# EAGLE design common (EAGLE 9.6.1)
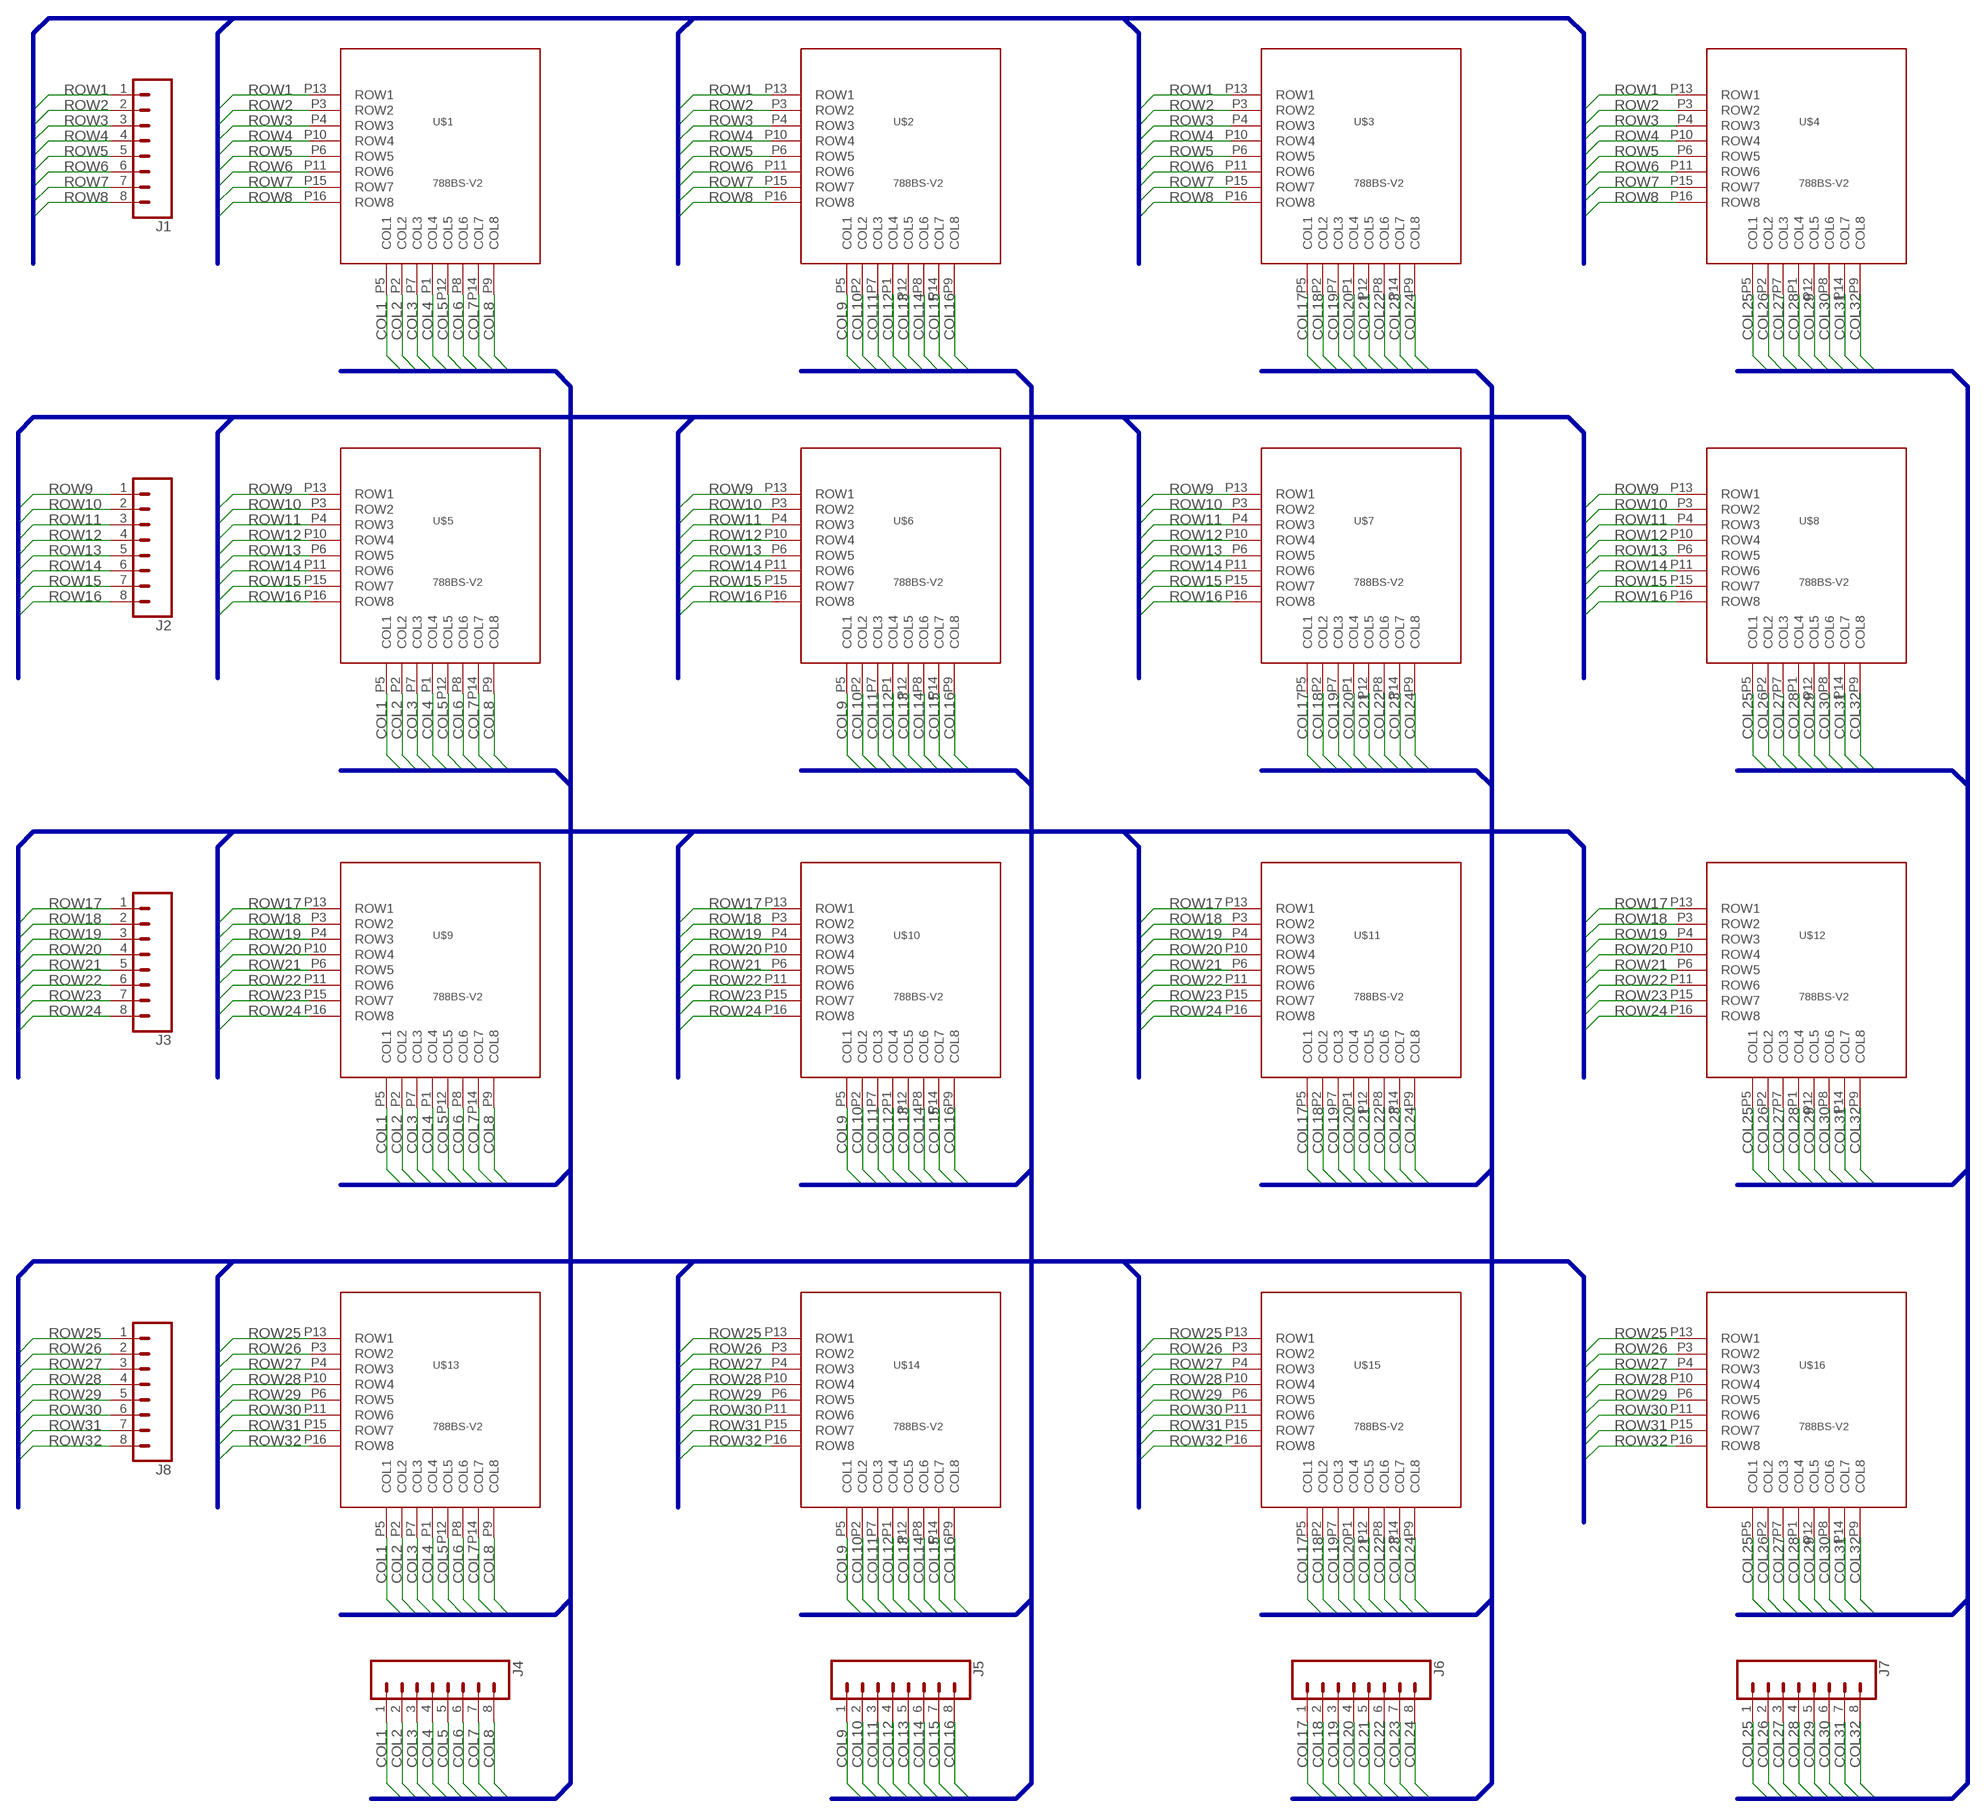
[diagram p0: schematic, sheet 1]

## Parts
J1  CONN_08"  [1X08]
J2  CONN_08"  [1X08]
J3  CONN_08"  [1X08]
J4  CONN_08"  [1X08]
J5  CONN_08"  [1X08]
J6  CONN_08"  [1X08]
J7  CONN_08"  [1X08]
J8  CONN_08"  [1X08]
U$1  788BS-V2  [788BS8X81.9MM-V2]
U$2  788BS-V2  [788BS8X81.9MM-V2]
U$3  788BS-V2  [788BS8X81.9MM-V2]
U$4  788BS-V2  [788BS8X81.9MM-V2]
U$5  788BS-V2  [788BS8X81.9MM-V2]
U$6  788BS-V2  [788BS8X81.9MM-V2]
U$7  788BS-V2  [788BS8X81.9MM-V2]
U$8  788BS-V2  [788BS8X81.9MM-V2]
U$9  788BS-V2  [788BS8X81.9MM-V2]
U$10  788BS-V2  [788BS8X81.9MM-V2]
U$11  788BS-V2  [788BS8X81.9MM-V2]
U$12  788BS-V2  [788BS8X81.9MM-V2]
U$13  788BS-V2  [788BS8X81.9MM-V2]
U$14  788BS-V2  [788BS8X81.9MM-V2]
U$15  788BS-V2  [788BS8X81.9MM-V2]
U$16  788BS-V2  [788BS8X81.9MM-V2]

## Nets
COL1: J4.1 U$1.P5(COL1) U$5.P5(COL1) U$9.P5(COL1) U$13.P5(COL1)
COL2: J4.2 U$1.P2(COL2) U$5.P2(COL2) U$9.P2(COL2) U$13.P2(COL2)
COL3: J4.3 U$1.P7(COL3) U$5.P7(COL3) U$9.P7(COL3) U$13.P7(COL3)
COL4: J4.4 U$1.P1(COL4) U$5.P1(COL4) U$9.P1(COL4) U$13.P1(COL4)
COL5: J4.5 U$1.P12(COL5) U$5.P12(COL5) U$9.P12(COL5) U$13.P12(COL5)
COL6: J4.6 U$1.P8(COL6) U$5.P8(COL6) U$9.P8(COL6) U$13.P8(COL6)
COL7: J4.7 U$1.P14(COL7) U$5.P14(COL7) U$9.P14(COL7) U$13.P14(COL7)
COL8: J4.8 U$1.P9(COL8) U$5.P9(COL8) U$9.P9(COL8) U$13.P9(COL8)
COL9: J5.1 U$2.P5(COL1) U$6.P5(COL1) U$10.P5(COL1) U$14.P5(COL1)
COL10: J5.2 U$2.P2(COL2) U$6.P2(COL2) U$10.P2(COL2) U$14.P2(COL2)
COL11: J5.3 U$2.P7(COL3) U$6.P7(COL3) U$10.P7(COL3) U$14.P7(COL3)
COL12: J5.4 U$2.P1(COL4) U$6.P1(COL4) U$10.P1(COL4) U$14.P1(COL4)
COL13: J5.5 U$2.P12(COL5) U$6.P12(COL5) U$10.P12(COL5) U$14.P12(COL5)
COL14: J5.6 U$2.P8(COL6) U$6.P8(COL6) U$10.P8(COL6) U$14.P8(COL6)
COL15: J5.7 U$2.P14(COL7) U$6.P14(COL7) U$10.P14(COL7) U$14.P14(COL7)
COL16: J5.8 U$2.P9(COL8) U$6.P9(COL8) U$10.P9(COL8) U$14.P9(COL8)
COL17: J6.1 U$3.P5(COL1) U$7.P5(COL1) U$11.P5(COL1) U$15.P5(COL1)
COL18: J6.2 U$3.P2(COL2) U$7.P2(COL2) U$11.P2(COL2) U$15.P2(COL2)
COL19: J6.3 U$3.P7(COL3) U$7.P7(COL3) U$11.P7(COL3) U$15.P7(COL3)
COL20: J6.4 U$3.P1(COL4) U$7.P1(COL4) U$11.P1(COL4) U$15.P1(COL4)
COL21: J6.5 U$3.P12(COL5) U$7.P12(COL5) U$11.P12(COL5) U$15.P12(COL5)
COL22: J6.6 U$3.P8(COL6) U$7.P8(COL6) U$11.P8(COL6) U$15.P8(COL6)
COL23: J6.7 U$3.P14(COL7) U$7.P14(COL7) U$11.P14(COL7) U$15.P14(COL7)
COL24: J6.8 U$3.P9(COL8) U$7.P9(COL8) U$11.P9(COL8) U$15.P9(COL8)
COL25: J7.1 U$4.P5(COL1) U$8.P5(COL1) U$12.P5(COL1) U$16.P5(COL1)
COL26: J7.2 U$4.P2(COL2) U$8.P2(COL2) U$12.P2(COL2) U$16.P2(COL2)
COL27: J7.3 U$4.P7(COL3) U$8.P7(COL3) U$12.P7(COL3) U$16.P7(COL3)
COL28: J7.4 U$4.P1(COL4) U$8.P1(COL4) U$12.P1(COL4) U$16.P1(COL4)
COL29: J7.5 U$4.P12(COL5) U$8.P12(COL5) U$12.P12(COL5) U$16.P12(COL5)
COL30: J7.6 U$4.P8(COL6) U$8.P8(COL6) U$12.P8(COL6) U$16.P8(COL6)
COL31: J7.7 U$4.P14(COL7) U$8.P14(COL7) U$12.P14(COL7) U$16.P14(COL7)
COL32: J7.8 U$4.P9(COL8) U$8.P9(COL8) U$12.P9(COL8) U$16.P9(COL8)
ROW1: J1.1 U$1.P13(ROW1) U$2.P13(ROW1) U$3.P13(ROW1) U$4.P13(ROW1)
ROW2: J1.2 U$1.P3(ROW2) U$2.P3(ROW2) U$3.P3(ROW2) U$4.P3(ROW2)
ROW3: J1.3 U$1.P4(ROW3) U$2.P4(ROW3) U$3.P4(ROW3) U$4.P4(ROW3)
ROW4: J1.4 U$1.P10(ROW4) U$2.P10(ROW4) U$3.P10(ROW4) U$4.P10(ROW4)
ROW5: J1.5 U$1.P6(ROW5) U$2.P6(ROW5) U$3.P6(ROW5) U$4.P6(ROW5)
ROW6: J1.6 U$1.P11(ROW6) U$2.P11(ROW6) U$3.P11(ROW6) U$4.P11(ROW6)
ROW7: J1.7 U$1.P15(ROW7) U$2.P15(ROW7) U$3.P15(ROW7) U$4.P15(ROW7)
ROW8: J1.8 U$1.P16(ROW8) U$2.P16(ROW8) U$3.P16(ROW8) U$4.P16(ROW8)
ROW9: J2.1 U$5.P13(ROW1) U$6.P13(ROW1) U$7.P13(ROW1) U$8.P13(ROW1)
ROW10: J2.2 U$5.P3(ROW2) U$6.P3(ROW2) U$7.P3(ROW2) U$8.P3(ROW2)
ROW11: J2.3 U$5.P4(ROW3) U$6.P4(ROW3) U$7.P4(ROW3) U$8.P4(ROW3)
ROW12: J2.4 U$5.P10(ROW4) U$6.P10(ROW4) U$7.P10(ROW4) U$8.P10(ROW4)
ROW13: J2.5 U$5.P6(ROW5) U$6.P6(ROW5) U$7.P6(ROW5) U$8.P6(ROW5)
ROW14: J2.6 U$5.P11(ROW6) U$6.P11(ROW6) U$7.P11(ROW6) U$8.P11(ROW6)
ROW15: J2.7 U$5.P15(ROW7) U$6.P15(ROW7) U$7.P15(ROW7) U$8.P15(ROW7)
ROW16: J2.8 U$5.P16(ROW8) U$6.P16(ROW8) U$7.P16(ROW8) U$8.P16(ROW8)
ROW17: J3.1 U$9.P13(ROW1) U$10.P13(ROW1) U$11.P13(ROW1) U$12.P13(ROW1)
ROW18: J3.2 U$9.P3(ROW2) U$10.P3(ROW2) U$11.P3(ROW2) U$12.P3(ROW2)
ROW19: J3.3 U$9.P4(ROW3) U$10.P4(ROW3) U$11.P4(ROW3) U$12.P4(ROW3)
ROW20: J3.4 U$9.P10(ROW4) U$10.P10(ROW4) U$11.P10(ROW4) U$12.P10(ROW4)
ROW21: J3.5 U$9.P6(ROW5) U$10.P6(ROW5) U$11.P6(ROW5) U$12.P6(ROW5)
ROW22: J3.6 U$9.P11(ROW6) U$10.P11(ROW6) U$11.P11(ROW6) U$12.P11(ROW6)
ROW23: J3.7 U$9.P15(ROW7) U$10.P15(ROW7) U$11.P15(ROW7) U$12.P15(ROW7)
ROW24: J3.8 U$9.P16(ROW8) U$10.P16(ROW8) U$11.P16(ROW8) U$12.P16(ROW8)
ROW25: J8.1 U$13.P13(ROW1) U$14.P13(ROW1) U$15.P13(ROW1) U$16.P13(ROW1)
ROW26: J8.2 U$13.P3(ROW2) U$14.P3(ROW2) U$15.P3(ROW2) U$16.P3(ROW2)
ROW27: J8.3 U$13.P4(ROW3) U$14.P4(ROW3) U$15.P4(ROW3) U$16.P4(ROW3)
ROW28: J8.4 U$13.P10(ROW4) U$14.P10(ROW4) U$15.P10(ROW4) U$16.P10(ROW4)
ROW29: J8.5 U$13.P6(ROW5) U$14.P6(ROW5) U$15.P6(ROW5) U$16.P6(ROW5)
ROW30: J8.6 U$13.P11(ROW6) U$14.P11(ROW6) U$15.P11(ROW6) U$16.P11(ROW6)
ROW31: J8.7 U$13.P15(ROW7) U$14.P15(ROW7) U$15.P15(ROW7) U$16.P15(ROW7)
ROW32: J8.8 U$13.P16(ROW8) U$14.P16(ROW8) U$15.P16(ROW8) U$16.P16(ROW8)

## Buses
XXX:ROW[1..8]
YYY:COL[1..8]
YYY2:COL[9..16]
YYY3:COL[17..24]
XXX2:ROW[9..16]
XXX3:ROW[17..24]
XXX4:ROW[25..32]
YYY4:COL[25..32]

## Library data of the parts
J1-J8 = SparkFun-Connectors:CONN_08: Multi connection point. Often used as Generic Header-pin footprint for 0.1 inch spaced/style header connections On any of the 0.1 inch spaced packages, you can populate with these: Break Away Headers - Straight <https://www.sparkfun.com/products/116> (PRT-00116) Break Away Male Headers - Right Angle <https://www.sparkfun.com/products/553> (PRT-00553) Female Headers <https://www.sparkfun.com/products/115> (PRT-00115) Break Away Headers - Machine Pin <https://www.sparkfun.com/products/117> (PRT-00117) Break Away Female Headers - Swiss Machine Pin <https://www.sparkfun.com/products/743> (PRT-00743) Arduino Stackable Header - 8 Pin <https://www.sparkfun.com/products/9279> (PRT-09279) For SCREWTERMINALS and SPRING TERMINALS visit here: Screw Terimnals on SparkFun.com <https://www.sparkfun.com/search/results?term=Screw+Terminals> (5mm/3.5mm/2.54mm spacing) This device is also useful as a general connection point to wire up your design to another part of your project. Our various solder wires solder well into these plated through hole pads. Hook-Up Wire - Assortment (Stranded, 22 AWG) <https://www.sparkfun.com/products/11375> (PRT-11375) Hook-Up Wire - Assortment (Solid Core, 22 AWG) <https://www.sparkfun.com/products/11367> (PRT-11367) View the entire wire category on our website here <https://www.sparkfun.com/categories/141> Special notes: Molex polarized connector foot print use with SKU : PRT-08231 with associated crimp pins and housings. 1MM SMD Version SKU: PRT-10208 NOTES ON THE VARIANTS LOCK and LOCK_LONGPADS... This footprint was designed to help hold the alignment of a through-hole component (i.e. 6-pin header) while soldering it into place. You may notice that each hole has been shifted either up or down by 0.005 of an inch from it's more standard position (which is a perfectly straight line). This slight alteration caused the pins (the squares in the middle) to touch the edges of the holes. Because they are alternating, it causes a "brace" to hold the component in place. 0.005 has proven to be the perfect amount of "off-center" position when using our standard breakaway headers. Although looks a little odd when you look at the bare footprint, once you have a header in there, the alteration is very hard to notice. Also,if you push a header all the way into place, it is covered up entirely on the bottom side.; PROD_ID: CONN-08438
U$1-U$16 = ledmatrix-v2:788BS-V2

## Board
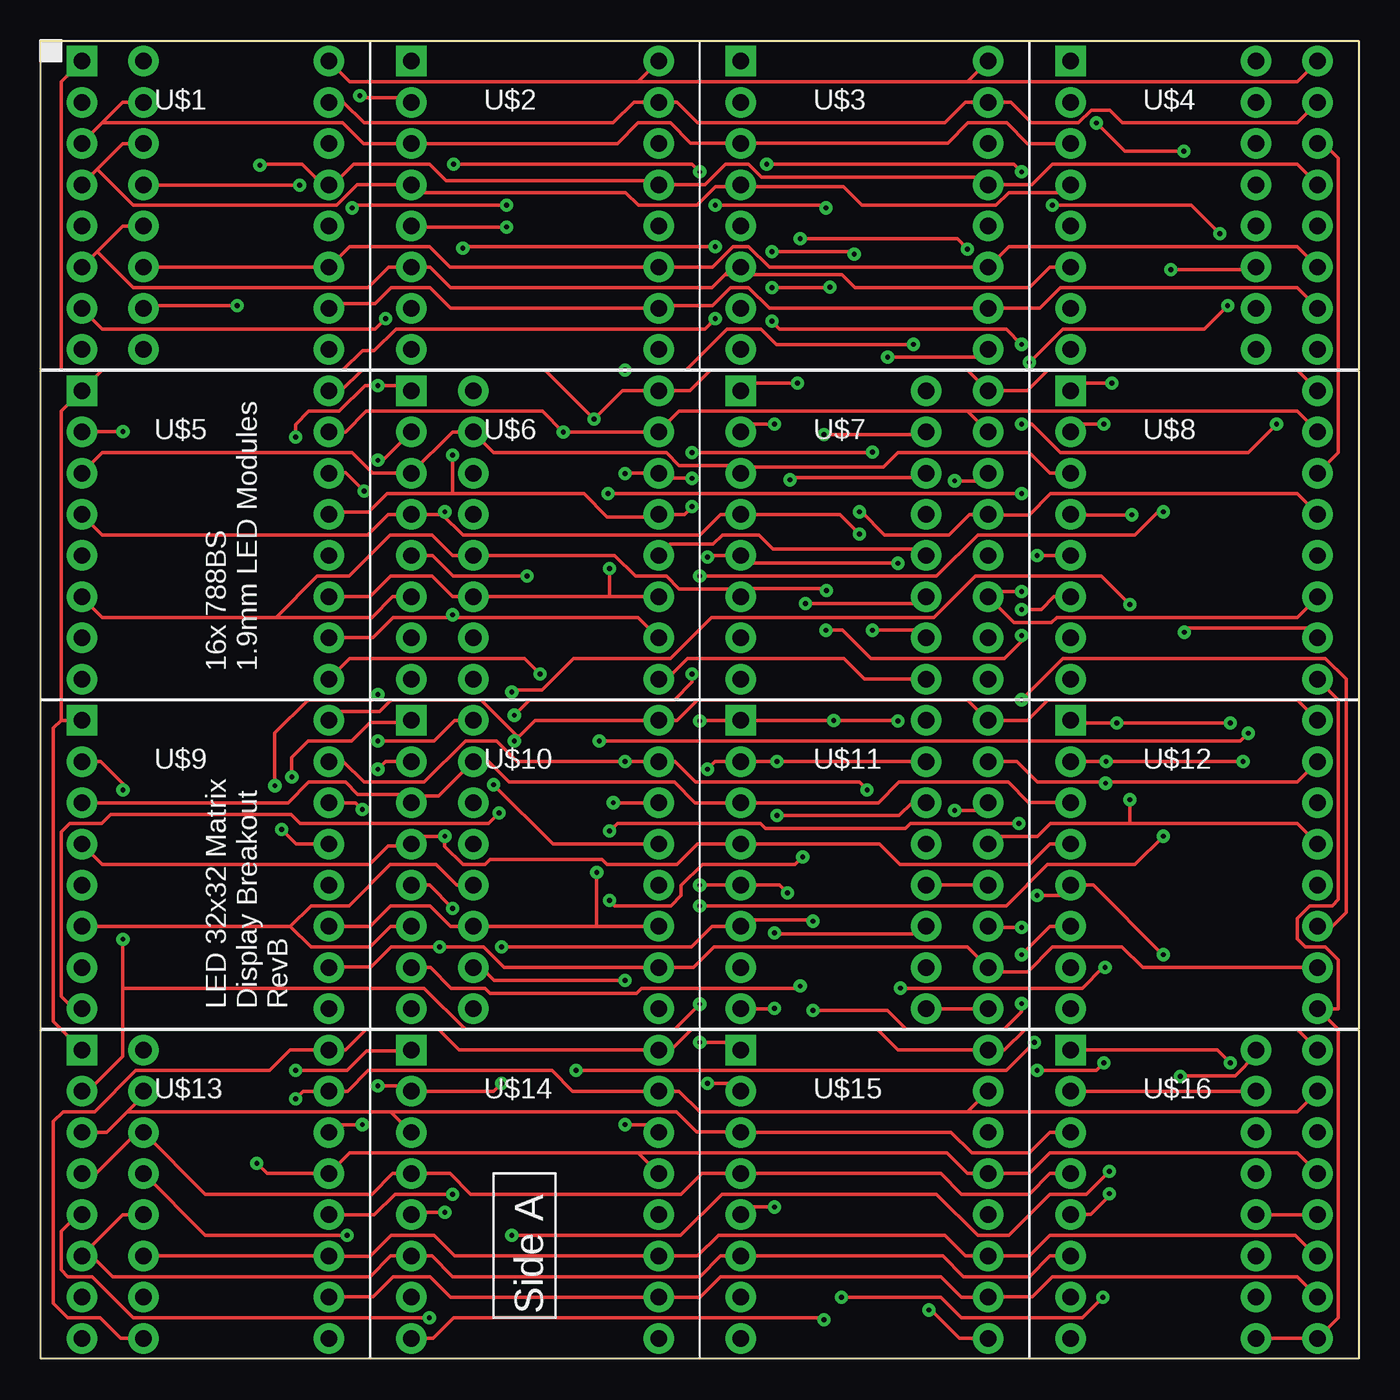
[diagram p1: board, top side]
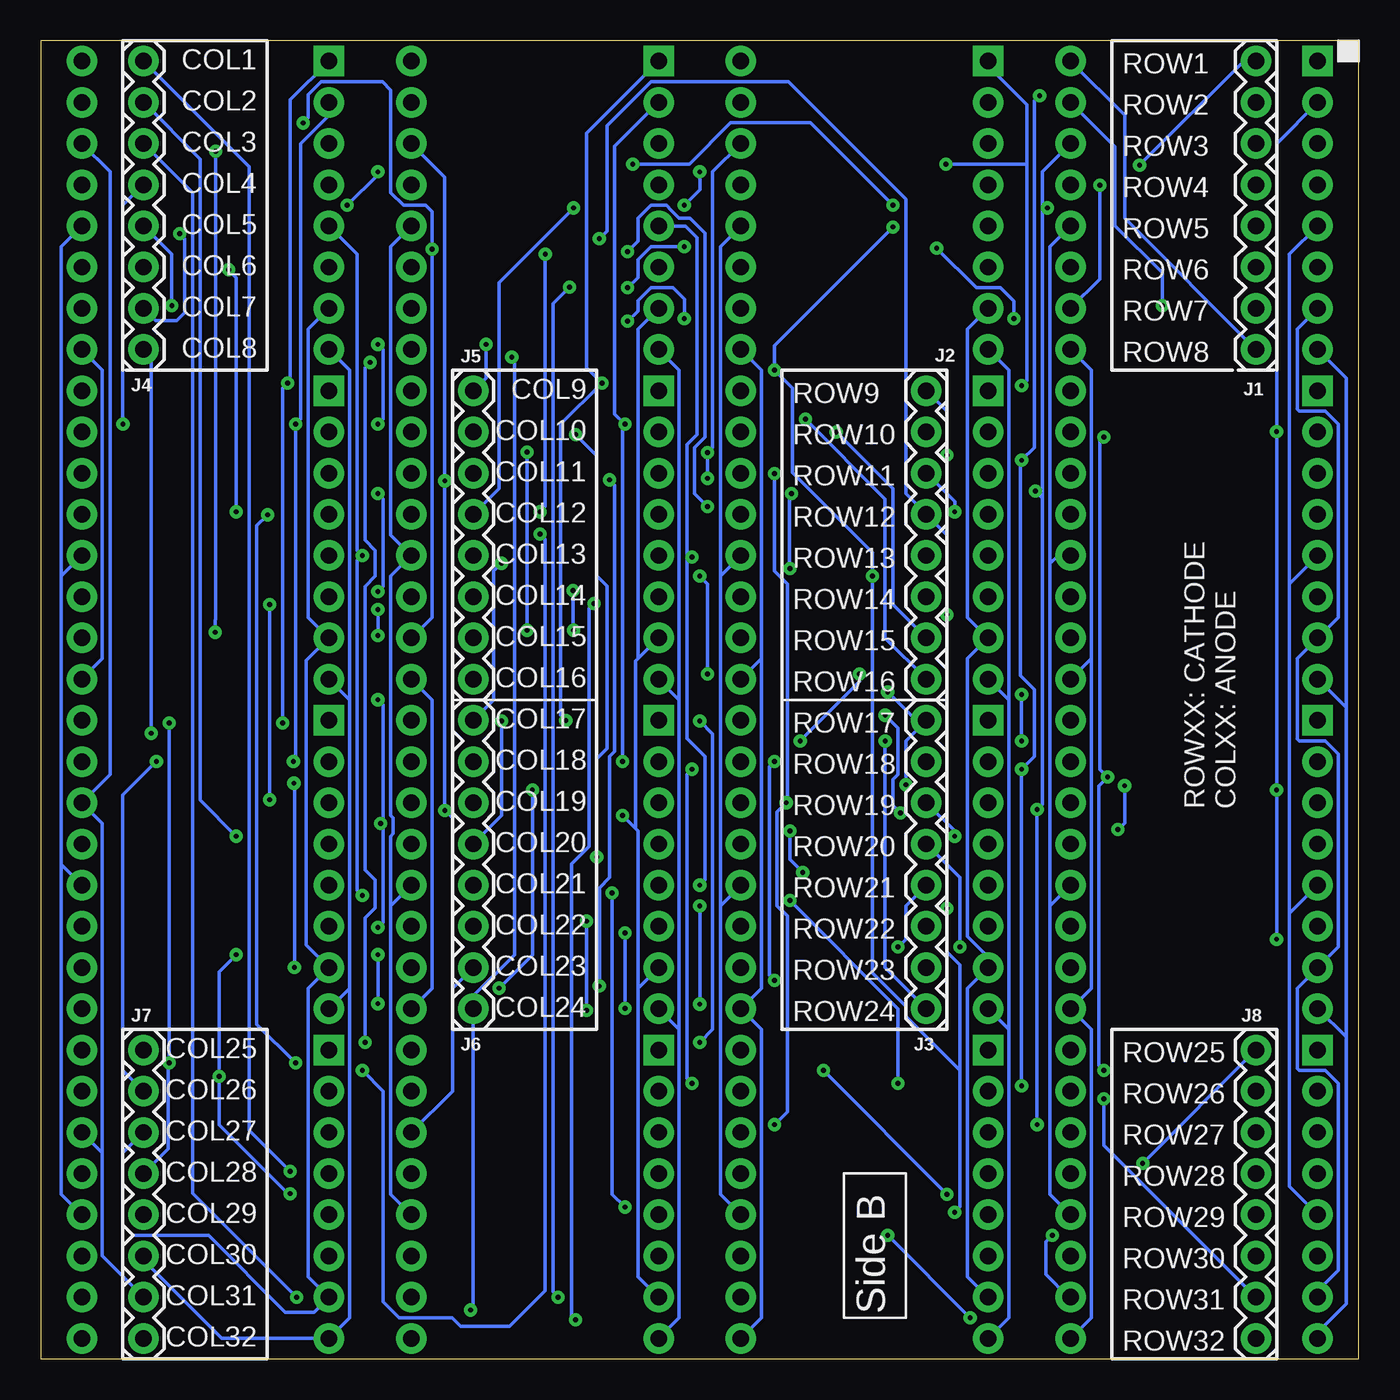
[diagram p2: board, bottom side, seen from below]

Size 81.28 x 81.28 mm. Coordinates in mm from the lower left corner, seen from the top.
Outline: 0,0 0,81.28 81.28,81.28 81.28,0 0,0
Copper layers (1*16): Top 0.035mm / dielectric 1.6mm / Bottom 0.035mm
Design rules "angelo-jlcpcb-2layers": minimum track width 8mil, minimum drill 0.3mm, track to track 6mil, track to pad 6mil, pad to pad 6mil, via to via 10mil, smd to smd 6mil, copper to edge 0.2mm, drill to drill 8mil, minimum pad ring 10mil, minimum via ring 10mil, stop-mask expansion 4mil, vias tented up to drill 0mil, thermal gap 10mil

### Footprints (pad centres in the part's own frame; a part is rotated, then mirrored left to right if it is on the bottom)
1X08 = drill 1.016 pad 1.88: 1 0,0; 2 2.54,0; 3 5.08,0; 4 7.62,0; 5 10.16,0; 6 12.7,0; 7 15.24,0; 8 17.78,0
788BS8X81.9MM-V2 = drill 1.016 pad 1.88 square: P1 0,0 | drill 1.016 pad 1.88: P2 0,-2.54; P3 0,-5.08; P4 0,-7.62; P5 0,-10.16; P6 0,-12.7; P7 0,-15.24; P8 0,-17.78; P9 15.24,-17.78; P10 15.24,-15.24; P11 15.24,-12.7; P12 15.24,-10.16; P13 15.24,-7.62; P14 15.24,-5.08; P15 15.24,-2.54; P16 15.24,0

### Placement (x,y rotation side)
J1  6.35,80.01 270 bottom
J2  26.67,59.69 270 bottom
J3  26.67,39.37 270 bottom
J4  74.93,80.01 270 bottom
J5  54.61,59.69 270 bottom
J6  54.61,39.37 270 bottom
J7  74.93,19.05 270 bottom
J8  6.35,19.05 270 bottom
U$1  2.54,80.01 0 top
U$2  22.86,80.01 0 top
U$3  43.18,80.01 0 top
U$4  63.5,80.01 0 top
U$5  2.54,59.69 0 top
U$6  22.86,59.69 0 top
U$7  43.18,59.69 0 top
U$8  63.5,59.69 0 top
U$9  2.54,39.37 0 top
U$10  22.86,39.37 0 top
U$11  43.18,39.37 0 top
U$12  63.5,39.37 0 top
U$13  2.54,19.05 0 top
U$14  22.86,19.05 0 top
U$15  43.18,19.05 0 top
U$16  63.5,19.05 0 top

### Tracks (layer width: path | path; a pad name or v marks a point on that pad's centre or on a via)
COL1  (via drill 0.3)
  Top 0.203: v65.88,11.56 64.48,10.16 62.23,10.16 59.69,7.62 57.78,7.62 55.24,10.16 42.01,10.16 39.47,7.62 v29.05,7.62 | v23.97,2.54 5.71,2.54 3.17,5.08 1.68,5.08 1.27,5.49 1.27,7.87 2.29,8.89 U$13.P5
  Bottom 0.203: U$13.P5 4.29,10.64 4.29,27.46 | U$9.P5 4.29,27.46 | 4.29,47.78 U$5.P5 | 4.29,27.46 4.29,47.78 | U$1.P5 4.29,68.1 4.29,47.78 | J4.1 68.42,73.5 68.42,14.1 v65.88,11.56 | v23.97,2.54 v29.05,7.62
COL2  (via drill 0.3)
  Top 0.203: U$13.P2 2.92,16.51 5.08,18.67 5.08,22.86 | v5.08,25.88 5.08,22.86 | v5.08,35.08 5.08,35.47 3.71,36.83 U$9.P2 | v5.08,57.18 2.57,57.18 U$5.P2 | v69.22,32.23 67.47,30.48 62.07,30.48 59.53,27.94 v40.64,27.94 | v40.64,21.88 39.08,20.32 26.19,20.32 23.65,22.86 5.08,22.86
  Bottom 0.203: v5.08,25.88 v5.08,35.08 v5.08,57.18 5.08,74.93 U$1.P2 | J4.2 71.44,73.98 71.44,34.45 v69.22,32.23 | v40.64,21.88 v40.64,27.94
COL3  (via drill 0.3)
  Top 0.203: v65.5,3.81 64.23,2.54 56.77,2.54 55.5,3.81 v49.37,3.81 | v48.67,66.07 48.64,66.04 v45.09,66.04 | v41.59,68.58 26.04,68.58 v26.04,68.48 | v21.27,64.14 20.64,63.5 3.81,63.5 U$1.P7
  Bottom 0.203: U$13.P7 2.54,4.19 1.27,5.46 1.27,16.99 2.06,17.78 3.68,17.78 3.81,17.91 3.81,22.86 U$9.P7 1.27,25.4 1.27,37.31 2.06,38.1 3.68,38.1 3.81,38.23 3.81,43.18 U$5.P7 1.27,45.72 1.27,57.63 2.06,58.42 3.68,58.42 3.81,58.55 3.81,63.5 U$1.P7 | J4.3 71.91,71.91 71.91,10.22 v65.5,3.81 | v49.37,3.81 49.69,4.13 49.69,65.06 v48.67,66.07 | v45.09,66.04 44.45,66.67 44.45,67.79 43.66,68.58 v41.59,68.58 | v26.04,68.48 23.59,66.04 22.1,66.04 21.27,65.22 v21.27,64.14
COL4  (via drill 0.3)
  Top 0.203: U$13.P1 0.79,20.8 0.79,38.89 1.27,39.37 | U$9.P1 1.27,39.37 | 1.27,39.37 1.27,58.42 U$5.P1 3.81,60.96 | v76.2,57.63 74.45,55.88 62.87,55.88 61.12,57.63 v60.48,57.63 | v60.48,62.55 59.53,63.5 45.56,63.5 v45.09,63.98 | v41.59,64.14 40.96,63.5 21.91,63.5 20.57,62.17 19.84,62.17 18.64,60.96 3.81,60.96 | U$1.P1 1.27,78.74 1.27,60.96 3.81,60.96
  Bottom 0.203: J4.4 76.2,71.12 v76.2,57.63 | v60.48,57.63 60.17,57.94 60.17,62.23 v60.48,62.55 | v45.09,63.98 44.45,64.61 44.45,65.25 43.66,66.04 42.29,66.04 41.59,65.34 v41.59,64.14
COL5  (via drill 0.3)
  Top 0.203: v73.18,64.93 71.75,63.5 63.02,63.5 v60.96,61.44 | v61.28,19.53 59.53,17.78 v33.02,17.78 | v25.4,10.16 21.84,10.16 20.57,8.89 U$13.P12
  Bottom 0.203: U$13.P12 19.05,10.16 19.05,27.94 | U$9.P12 19.05,27.94 | 19.05,49.02 18.54,49.53 U$5.P12 | 19.05,27.94 19.05,49.02 | U$1.P12 19.05,68.58 19.05,49.02 | J4.5 73.18,68.1 v73.18,64.93 | v60.96,61.44 61.28,61.12 61.28,50.48 60.64,49.85 60.64,48.26 61.28,47.62 61.28,30.16 60.64,29.53 60.64,27.81 61.28,27.18 v61.28,19.53 | v25.4,10.16 v33.02,17.78
COL6  (via drill 0.3)
  Top 0.203: J4.6 74.77,67.15 v69.69,67.15 | v69.22,52.23 68.9,52.23 67.47,50.8 57.78,50.8 55.24,48.26 v40.64,48.26 | v40.16,42.23 40.16,41.72 39.08,40.64 30.16,40.64 v29.21,39.69 | v28.26,33.66 27.62,33.02 16,33.02 15.46,33.56 4.32,33.56 3.78,33.02 1.81,33.02 1.27,32.48 1.27,22.35 2.03,21.59 U$9.P8
  Bottom 0.203: U$13.P8 2.54,1.65 0.79,3.4 0.79,19.84 | U$9.P8 0.79,19.84 | 0.79,40.16 U$5.P8 | 0.79,19.84 0.79,40.16 | U$1.P8 0.79,60.48 0.79,40.16 | v69.69,67.15 69.22,66.67 v69.22,52.23 | v40.64,48.26 40.16,47.78 v40.16,42.23 | v29.21,39.69 28.42,38.89 28.42,36.04 28.73,35.72 28.73,34.13 v28.26,33.66
COL7  (via drill 0.3)
  Top 0.203: U$13.P14 18.26,14.45 v19.84,14.45 | v19.84,33.88 19.43,34.29 U$9.P14 | U$5.P14 17.81,54.64 18.8,54.64 v19.94,53.5 | v72.71,69.37 70.96,71.12 v62.39,71.12 | v60.48,73.18 60.01,73.66 v44.77,73.66 | v28.73,71.12 19.37,71.12 v19.21,70.96
  Bottom 0.203: v19.84,14.45 v19.84,33.88 19.53,34.2 19.53,53.09 | U$1.P14 19.53,73.18 19.53,70.96 | 19.53,53.09 19.53,70.96 | 19.53,53.09 v19.94,53.5 | J4.7 74.17,64.01 72.9,64.01 72.39,64.52 72.39,69.06 v72.71,69.37 | v62.39,71.12 60.48,73.03 v60.48,73.18 | v44.77,73.66 41.27,73.66 38.73,76.2 33.81,76.2 v28.73,71.12 | 19.53,70.96 v19.21,70.96
COL8  (via drill 0.3)
  Top 0.203: v74.45,38.58 73.98,38.1 v34.45,38.1 | v30.8,42.23 29.84,43.18 19.05,43.18 U$5.P9
  Bottom 0.203: U$13.P9 16.51,2.54 16.51,20.32 U$9.P9 16.51,22.86 16.51,43.18 | 16.51,43.18 U$5.P9 | 16.51,43.18 16.51,60.96 U$1.P9 | J4.8 74.45,61.75 v74.45,38.58 | v34.45,38.1 30.8,41.75 v30.8,42.23
COL9  (via drill 0.3)
  Top 0.203: U$14.P5 23.02,9.05 v24.92,9.05 | v25.4,27.78 23.97,29.21 U$10.P5 | U$6.P5 24.16,49.53 25.43,48.26 v30,48.26 | v53.82,62.55 45.37,62.55 44.42,63.5 42.32,63.5 39.78,60.96 v36.04,60.96 | U$2.P5 22.92,69.79 v28.73,69.79
  Bottom 0.203: v24.92,9.05 24.61,9.37 24.61,17.78 | 24.61,17.78 24.61,24.29 25.4,25.08 v25.4,27.78 | 24.61,17.78 27.94,21.11 27.94,21.75 30,23.81 v30,48.26 30,49.72 34.92,54.64 34.92,59.85 v36.04,60.96 36.04,62.48 v28.73,69.79 | J5.1 53.82,60.48 v53.82,62.55
COL10  (via drill 0.3)
  Top 0.203: v20.8,16.83 22.54,16.83 U$14.P2 27.94,16.51 v28.42,16.99 | v20.8,36.35 21.27,36.83 U$10.P2 | U$6.P2 21.11,55.4 v20.8,55.4 | v19.68,77.88 19.81,77.76 22.57,77.76 U$2.P2 | J5.2 54.45,56.99 v48.29,56.99 | v46.99,30.96 46.51,30.48 40.8,30.48 39.5,29.18 39.5,28.57 38.86,27.94 35.4,27.94 v35.08,28.26
  Bottom 0.203: v20.8,16.83 v20.8,36.35 20,37.15 20,41.27 20.86,42.13 20.86,55.34 v20.8,55.4 20,56.2 20,77.56 v19.68,77.88 | v48.29,56.99 46.99,55.69 46.99,48.29 46.35,47.66 46.35,37.62 46.99,36.99 v46.99,30.96 | v35.08,28.26 28.42,21.59 v28.42,16.99
COL11  (via drill 0.3)
  Top 0.203: J5.3 54.32,54.32 46.32,54.32 v46.2,54.2 | v46.83,22.99 46.7,22.86 37.05,22.86 36.73,22.54 27.72,22.54 27.4,22.86 25.3,22.86 24.04,24.13 U$10.P7
  Bottom 0.203: U$2.P7 24.13,63.5 24.13,45.72 U$6.P7 24.13,43.18 24.13,26.04 22.86,24.77 U$10.P7 24.13,22.86 24.13,5.08 U$14.P7 | v46.2,54.2 45.88,53.88 45.88,37.47 46.2,37.15 46.2,29.69 46.83,29.05 v46.83,22.99
COL12  (via drill 0.3)
  Top 0.203: U$14.P1 22.8,18.99 20.1,18.99 18.89,17.78 v15.72,17.78 | v15.49,35.88 15.49,37.08 16.51,38.1 19.18,38.1 20.32,39.24 22.73,39.24 U$10.P1 | U$6.P1 22.54,60.01 v20.8,60.01 20,60.01 18.41,58.42 16.54,58.42 15.72,57.59 v15.72,56.83 | v48.42,70.96 48.26,71.12 v41.59,71.12 | v40.64,73.18 40.16,73.66 v25.46,73.66
  Bottom 0.203: v15.72,17.78 16.03,18.1 16.03,35.34 v15.49,35.88 15.97,36.35 15.97,56.58 v15.72,56.83 | v20.8,60.01 20.48,60.33 20.48,73.66 | 20.48,73.66 20.48,77.31 22.86,79.69 U$2.P1 | J5.4 53.02,53.66 53.02,66.36 v48.42,70.96 | v41.59,71.12 40.64,72.07 v40.64,73.18 | 20.48,73.66 v25.46,73.66
COL13
  Top 0.203: J5.5 54.2,49.94 45.15,49.94 44.29,50.8 42.04,50.8 41.47,50.23 38.8,50.23 U$6.P12
  Bottom 0.203: U$14.P12 39.37,10.16 39.37,27.94 | U$10.P12 39.37,27.94 | 39.37,48.26 U$6.P12 | 39.37,27.94 39.37,48.26 | U$2.P12 39.37,68.58 39.37,48.26
COL14  (via drill 0.3)
  Top 0.203: J5.6 54.2,46.58 v47.15,46.58 | v48.29,2.41 48.16,2.54 25.46,2.54 24.19,1.27 U$14.P8
  Bottom 0.203: U$14.P8 21.59,2.54 21.59,20.32 | U$10.P8 21.59,20.32 | 21.59,40.64 U$6.P8 | 21.59,20.32 21.59,40.64 | v47.15,46.58 47.47,46.26 47.47,31.59 48.55,30.51 48.55,2.67 v48.29,2.41 | U$2.P8 21.59,60.96 21.59,40.64
COL15  (via drill 0.3)
  Top 0.203: U$14.P14 37.62,14.45 v36.04,14.45 | U$10.P14 v35.31,34.29 | J5.7 54.13,44.93 v51.28,44.93 | v51.28,55.91 51.24,55.88 v40.16,55.88 | v40.16,54.29 38.42,54.29 U$6.P14 36.07,54.61 v36.04,54.58
  Bottom 0.203: v36.04,14.45 35.24,15.24 35.24,27.3 35.88,27.94 35.88,33.72 v35.31,34.29 35.24,34.35 35.24,47.78 36.04,48.58 v36.04,54.58 | v51.28,55.91 v51.28,44.93 | U$2.P14 39.85,73.18 39.85,56.2 v40.16,55.88 v40.16,54.29
COL16
  Top 0.203: U$6.P9 38.61,41.91 39.88,43.18 49.53,43.18 50.8,41.91 J5.8
  Bottom 0.203: U$14.P9 36.83,2.54 36.83,20.32 U$10.P9 36.83,22.86 36.83,43.18 | U$2.P9 36.83,60.96 36.83,43.18 | U$6.P9 36.83,43.18
COL17  (via drill 0.3)
  Top 0.203: U$15.P5 43.66,9.37 v45.24,9.37 | v46.04,28.73 45.56,29.21 U$11.P5 v40.64,29.21 | v52.86,49.05 43.66,49.05 U$7.P5 41.21,49.53 v41.12,49.44
  Bottom 0.203: v45.24,9.37 46.04,10.16 v46.04,28.73 | v52.86,49.05 53.34,48.58 53.34,40.64 J6.1 | U$3.P5 41.53,69.85 40.8,69.12 40.8,56.99 41.43,56.36 41.43,49.75 | v41.12,49.44 41.43,49.75 | v40.64,29.21 40.32,29.53 40.32,37.15 41.43,38.26 41.43,49.75
COL18  (via drill 0.3)
  Top 0.203: U$7.P2 43.66,57.63 v45.24,57.63 | U$15.P2 42.7,16.99 v41.12,16.99 | v41.12,36.35 41.59,36.83 U$11.P2 v45.4,36.83 J6.2
  Bottom 0.203: U$3.P2 45.88,74.77 45.88,58.26 v45.24,57.63 45.4,57.47 v45.4,36.83 | v41.12,16.99 41.43,17.3 41.43,36.04 v41.12,36.35
COL19  (via drill 0.3)
  Top 0.203: J6.3 53.72,34.29 52.93,33.5 v45.4,33.5
  Bottom 0.203: U$15.P7 44.45,5.08 44.45,22.86 | U$11.P7 44.45,22.86 | 44.61,32.7 44.45,32.54 44.45,22.86 | 44.61,32.7 v45.4,33.5 | 44.45,43.18 44.61,43.02 44.61,32.7 | 44.45,43.18 U$7.P7 | U$3.P7 44.45,63.5 44.45,43.18
COL20  (via drill 0.3)
  Top 0.203: U$7.P1 43.66,60.17 v46.67,60.17 | U$15.P1 42.7,19.53 v40.64,19.53 | v40.64,39.34 40.67,39.37 U$11.P1 v48.9,39.37 52.83,39.37 v52.86,39.34
  Bottom 0.203: U$3.P1 47.62,75.56 47.62,61.12 v46.67,60.17 49.21,57.63 49.21,39.69 v48.9,39.37 | v40.64,19.53 39.85,20.32 39.85,38.54 v40.64,39.34 | J6.4 52.86,33.5 v52.86,39.34
COL21
  Top 0.203: U$11.P12 J6.5
  Bottom 0.203: U$3.P12 59.69,68.58 59.69,50.8 U$7.P12 59.69,48.26 59.69,33.5 59.53,33.34 59.53,32.38 59.69,32.23 59.69,27.94 | U$15.P12 59.69,10.16 59.69,27.94 | U$11.P12 59.69,27.94
COL22  (via drill 0.3)
  Top 0.203: J6.6 54.13,26.19 45.31,26.19 v45.24,26.26 | v45.24,21.62 45.21,21.59 U$11.P8
  Bottom 0.203: U$15.P8 41.91,2.54 41.91,20.32 | U$11.P8 41.91,20.32 | v45.24,21.62 v45.24,26.26 | 41.91,40.64 U$7.P8 | 41.91,20.32 41.91,40.64 | U$3.P8 41.91,60.96 41.91,40.64
COL23  (via drill 0.3)
  Top 0.203: U$11.P14 57.94,33.81 v56.36,33.81 | U$7.P14 57.94,54.13 v56.36,54.13
  Bottom 0.203: U$15.P14 55.88,16.51 55.88,22.86 | J6.7 55.88,22.86 | 55.88,22.86 55.88,33.34 v56.36,33.81 v56.36,54.13 56.36,72.87 U$3.P14
COL24  (via drill 0.3)
  Top 0.203: U$15.P9 56.64,1.27 54.9,3.02 v54.77,3.02 | J6.8 U$11.P9 | U$3.P9 57.94,61.75 v52.23,61.75
  Bottom 0.203: v54.77,3.02 54.61,3.17 J6.8 54.61,22.38 52.07,24.92 52.07,61.59 v52.23,61.75 | U$7.P9 57.15,40.64 57.15,22.86 U$11.P9
COL25  (via drill 0.3)
  Top 0.203: v61.44,49.53 U$8.P5 | U$16.P5 63.53,8.92 64.74,8.92 65.88,10.06 v65.88,10.19 | v70.26,17.43 70.26,17.46 73.66,17.46 74.93,18.73 J7.1 | v69.22,24.92 69.18,24.92 64.9,29.21 U$12.P5 62.87,28.57 v61.44,28.57
  Bottom 0.203: U$4.P5 61.75,68.1 61.75,49.85 v61.44,49.53 61.75,49.21 61.75,28.89 v61.44,28.57 | v65.88,10.19 66.01,10.19 70.26,14.45 v70.26,17.43 70.26,23.88 v69.22,24.92
COL26  (via drill 0.3)
  Top 0.203: U$8.P2 63.98,57.63 v65.56,57.63 | J7.2 U$16.P2 | v74.14,36.83 v65.69,36.83 U$12.P2
  Bottom 0.203: U$4.P2 63.5,76.68 65.25,74.93 65.25,57.94 v65.56,57.63 65.56,36.96 v65.69,36.83 | v74.14,36.83 76.2,34.77 76.2,17.78 J7.2
COL27
  Bottom 0.203: U$4.P7 64.77,63.5 64.77,45.72 U$8.P7 64.9,43.05 64.9,25.53 U$12.P7 64.77,22.86 64.77,5.08 U$16.P7 64.42,2.89 66.2,2.89 70.93,7.62 75.56,7.62 76.2,8.26 76.2,12.7 J7.3
COL28  (via drill 0.3)
  Top 0.203: U$8.P1 63.98,60.17 v66.04,60.17 | U$16.P1 72.55,19.05 v73.34,18.26 | U$12.P1 63.66,39.21 v66.36,39.21 v73.34,39.21
  Bottom 0.203: U$4.P1 65.88,77.63 65.88,60.33 v66.04,60.17 66.36,59.85 v66.36,39.21 | J7.4 73.41,12.95 73.41,18.19 v73.34,18.26 v73.34,39.21
COL29
  Top 0.203: U$16.P12 J7.5
  Bottom 0.203: 80.01,30.48 U$12.P12 | 80.01,48.26 80.01,30.48 | U$8.P12 80.01,48.26 | U$4.P12 80.01,68.58 80.01,48.26 | U$16.P12 80.01,10.16 80.01,30.48
COL30
  Bottom 0.203: J7.6 74.93,6.1 70.1,1.27 U$16.P8 62.23,2.54 62.23,22.86 | 62.23,22.86 U$12.P8 | 62.23,40.64 62.23,22.86 | U$8.P8 62.23,40.64 | U$4.P8 62.23,60.96 62.23,40.64
COL31
  Top 0.203: U$8.P14 80.01,55.88 80.01,74.04 79.12,74.93 U$4.P14
  Bottom 0.203: J7.7 77.47,6.35 77.47,12.7 | U$16.P14 77.47,12.7 | 77.47,12.7 77.47,33.02 U$12.P14 76.99,36.04 76.99,73.18 U$4.P14
COL32
  Top 0.203: J7.8 U$16.P9 80.01,2.54 80.01,20.32 U$12.P9 80.01,21.59 80.01,24.61 79.22,25.4 77.98,25.4 77.47,25.91 77.47,27.15 78.26,27.94 79.63,27.94 80.01,28.32 80.01,40.64 U$8.P9
  Bottom 0.203: U$8.P9 77.47,43.18 77.47,60.96 U$4.P9
ROW1  (via drill 0.3)
  Top 0.203: U$4.P13 77.47,73.66 62.39,73.66 61.12,72.39 U$3.P13 57.94,72.87 44.45,72.87 43.66,73.66 42.23,73.66 40.96,72.39 U$2.P13 37.85,72.64 24.99,72.64 23.97,73.66 19.3,73.66 18.03,72.39 U$1.P13 17.4,72.39 16.13,73.66 13.59,73.66 v13.53,73.6
  Bottom 0.203: v13.53,73.6 7.11,80.01 J1.1
ROW2
  Top 0.203: U$4.P3 60.83,74.93 59.56,76.2 57.18,76.2 55.94,74.96 43.21,74.96 U$3.P3 43.15,74.96 40.07,74.96 38.83,76.2 36.83,76.2 35.56,74.93 U$2.P3 19.91,74.93 18.64,76.2 3.81,76.2 | 3.81,76.2 5.08,77.47 J1.2 | 3.81,76.2 U$1.P3
ROW3
  Top 0.203: 3.49,73.34 5.08,74.93 J1.3 | 3.49,73.34 U$1.P4 | U$4.P4 63.02,71.91 59.69,71.91 58.9,71.12 50.64,71.12 49.5,72.26 43.31,72.26 U$3.P4 43.05,72.26 41.62,72.26 40.48,71.12 36.86,71.12 36.07,71.91 23.34,71.91 U$2.P4 19.53,72.39 18.26,71.12 5.71,71.12 3.49,73.34
ROW4  (via drill 0.3)
  Top 0.203: U$1.P10 18.07,65.06 20.64,65.06 21.62,66.04 24,66.04 25.27,64.77 U$2.P10 38.26,64.93 41.43,64.93 42.55,66.04 43.66,66.04 44.93,64.77 U$3.P10 61.59,64.77 62.87,66.04 77.47,66.04 U$4.P10 | J1.4 6.38,72.36 v15.97,72.36
  Bottom 0.203: v15.97,72.36 15.97,66.58 U$1.P10
ROW5
  Top 0.203: 3.49,68.26 5.08,69.85 J1.5 | 3.49,68.26 U$1.P6 | 42.2,66.83 41.4,66.04 25.27,66.04 24,67.31 U$2.P6 21.46,67.31 20.19,66.04 5.71,66.04 3.49,68.26 | U$4.P6 62.23,67.31 60.96,66.04 50.2,66.04 49.4,66.83 42.2,66.83 | U$3.P6 42.67,67.31 42.2,66.83
ROW6
  Top 0.203: U$4.P11 77.47,68.58 59.69,68.58 U$3.P11 44.93,67.31 43.66,68.58 42.7,68.58 41.43,67.31 U$2.P11 25.24,67.31 23.97,68.58 19.05,68.58 U$1.P11 J1.6
ROW7  (via drill 0.3)
  Top 0.203: J1.7 6.51,64.93 v12.13,64.93 | U$1.P15 18.67,77.47 19.94,76.2 35.31,76.2 36.58,77.47 U$2.P15 39.24,77.47 40.51,76.2 55.75,76.2 57.02,77.47 U$3.P15 59.82,77.47 61.09,76.2 63.98,76.2 64.77,76.99 65.91,76.99 66.71,76.2 77.47,76.2 U$4.P15
  Bottom 0.203: v12.13,64.93 12.13,66.96 15.05,69.88 15.05,74.74 U$1.P15
ROW8
  Top 0.203: 36.83,78.74 U$2.P16 | 36.83,78.74 19.05,78.74 U$1.P16 | 57.15,78.74 U$3.P16 | 36.83,78.74 57.15,78.74 | U$4.P16 77.47,78.74 57.15,78.74
  Bottom 0.203: J1.8 14.45,70.33 14.45,76.68 U$1.P16
ROW9  (via drill 0.3)
  Top 0.203: U$8.P13 77.47,53.34 62.26,53.34 60.96,52.04 58.45,52.04 U$7.P13 57.28,52.07 56.01,50.8 52.04,50.8 50.61,52.23 v50.48,52.23 | U$5.P13 17.91,52.2 20.23,52.2 21.37,53.34 25.4,53.34 | 25.4,53.34 33.5,53.34 34.92,51.91 37.94,51.91 U$6.P13 39.69,52.07 v40.16,52.55 | 25.4,53.34 v25.4,55.72 | v50.16,68.1 50.01,68.26 v45.09,68.26
  Bottom 0.203: J2.1 25.4,58.42 v25.4,55.72 | v50.48,52.23 50.16,52.55 v50.16,68.1 | v45.09,68.26 44.45,68.9 44.45,70.33 43.66,71.12 42.7,71.12 42.39,70.8 41.91,70.33 41.24,70.33 40.32,69.41 40.32,56.83 40.96,56.2 40.96,53.34 v40.16,52.55
ROW10
  Top 0.203: U$5.P3 3.81,55.88 19.21,55.88 20.48,54.61 U$6.P3 25.4,57.15 J2.2 27.94,55.88 38.58,55.88 39.37,55.09 42.7,55.09 U$7.P3 43.56,54.99 51.98,54.99 52.86,55.88 60.96,55.88 62.23,54.61 U$8.P3
ROW11  (via drill 0.3)
  Top 0.203: U$5.P4 3.81,50.8 20.16,50.8 21.43,52.07 U$6.P4 24.77,52.07 | 24.77,52.07 26.04,50.8 40.64,50.8 41.91,52.07 U$7.P4 49.28,52.07 v50.48,50.86 | U$8.P4 63.53,52.04 v67.28,52.04 | v65.56,18.26 65.09,17.78 v61.44,17.78 | 24.77,52.07 v24.92,52.23
  Bottom 0.203: v67.28,52.04 67.94,51.37 67.94,20.64 v65.56,18.26 | v61.44,17.78 60.17,16.51 60.17,3.52 59.18,2.54 55.91,2.54 55.37,2 52.36,2 50.16,4.19 50.16,50.55 v50.48,50.86 | J2.3 24.92,52.86 v24.92,52.23
ROW12  (via drill 0.3)
  Top 0.203: U$5.P10 17.81,44.48 20.51,44.48 21.75,45.72 25.4,45.72 | 25.4,45.72 36.83,45.72 U$6.P10 | v57.15,68.42 56.52,69.06 v46.83,69.06 | U$8.P10 78.14,45.05 70.77,45.05 v70.52,44.8 | v70.48,74.45 66.83,74.45 v65.09,76.2 | v25.4,45.88 25.4,45.72
  Bottom 0.203: U$7.P10 57.15,45.72 v57.15,68.42 57.15,70.74 57.53,71.12 58.9,71.12 59.69,71.91 59.69,78.23 60.2,78.74 63.98,78.74 64.77,77.95 64.77,76.52 v65.09,76.2 | v46.83,69.06 46.35,69.53 46.35,76.04 43.66,78.74 35.18,78.74 27.94,71.5 27.94,53.34 J2.4 25.4,50.8 v25.4,45.88 | v70.52,44.8 70.52,45.56 70.48,45.59 v70.48,74.45
ROW13  (via drill 0.3)
  Top 0.203: U$5.P6 3.81,45.72 14.51,45.72 | 14.51,45.72 20.45,45.72 21.72,46.99 U$6.P6 | 14.51,45.72 17.05,48.26 19.02,48.26 21.56,50.8 24.13,50.8 25.4,49.53 J2.5 35.4,49.53 36.67,48.26 38.58,48.26 39.37,47.47 42.7,47.47 U$7.P6 43.69,47.5 48.32,47.5 v48.45,47.37 | U$8.P6 62.48,46.99 61.69,46.2 v60.48,46.2 | v60.48,44.61 60.48,44.23 59.44,43.18 51.18,43.18 49.44,44.93 v48.42,44.93
  Bottom 0.203: v60.48,44.61 v60.48,46.2 | v48.42,44.93 48.45,44.96 v48.45,47.37
ROW14  (via drill 0.3)
  Top 0.203: U$5.P11 20.32,46.99 21.59,48.26 24.13,48.26 25.4,46.99 J2.6 35.08,46.99 | 35.08,46.99 U$6.P11 | 58.47,46.94 60.01,45.4 62.33,45.4 62.64,45.72 77.47,45.72 U$8.P11 | 58.47,46.94 U$7.P11 | v35.08,48.74 35.08,46.99 | v60.48,53.34 v34.99,53.34 | 58.47,46.94 58.83,47.31 v60.48,47.31
  Bottom 0.203: v35.08,48.74 35.12,48.77 35.12,53.21 v34.99,53.34 | v60.48,53.34 60.17,53.02 60.17,47.62 v60.48,47.31
ROW15  (via drill 0.3)
  Top 0.203: U$5.P15 18.8,57.15 20.07,58.42 30.96,58.42 v32.23,57.15 U$6.P15 39.37,58.42 57.15,58.42 | 57.15,58.42 U$7.P15 | U$8.P15 77.47,58.42 57.15,58.42
  Bottom 0.203: J2.7 28.73,46.51 28.73,53.66 v32.23,57.15
ROW16  (via drill 0.3)
  Top 0.203: U$5.P16 18.54,59.69 19.81,60.96 31.11,60.96 v34.13,57.94 35.88,59.69 U$6.P16 40.04,59.69 41.31,60.96 57.15,60.96 U$7.P16 60.83,59.69 62.1,60.96 77.47,60.96 U$8.P16
  Bottom 0.203: J2.8 29.21,44.45 29.21,53.02 v34.13,57.94
ROW17  (via drill 0.3)
  Top 0.203: U$11.P13 58.9,32.23 61.47,32.23 62.26,33.02 67.15,33.02 | 67.15,33.02 77.47,33.02 U$12.P13 | U$9.P13 15.75,31.75 v14.86,32.64 | v14.45,35.34 14.45,38.58 16.51,40.64 20.48,40.64 v20.8,40.96 | v20.8,38.1 24.26,38.1 25.53,39.37 J3.1 | U$10.P13 31.59,31.75 v27.94,35.4 | v67.15,34.48 67.15,33.02 | v67.15,46.51 65.41,48.26 57.63,48.26 55.09,45.72 41.37,45.72 38.83,43.18 32.86,43.18 30.92,41.24 29.18,41.24 v29.05,41.12
  Bottom 0.203: v14.86,32.64 14.45,33.05 v14.45,35.34 | v20.8,38.1 v20.8,40.96 | v27.94,35.4 27.94,38.1 26.99,39.05 | v67.15,46.51 v67.15,34.48 | 26.99,39.05 v29.05,41.12 | 26.99,39.05 J3.1
ROW18
  Top 0.203: U$9.P3 15.27,34.29 16.54,35.56 18.8,35.56 19.56,34.8 22.35,34.8 U$10.P3 23.27,34.7 24.54,34.7 J3.2 27.62,36.83 28.89,35.56 39.08,35.56 40.35,34.29 U$11.P3 51.66,34.29 52.93,35.56 59.66,35.56 60.9,34.32 63.47,34.32 U$12.P3
ROW19  (via drill 0.3)
  Top 0.203: U$12.P4 62.23,31.75 60.96,30.48 52.99,30.48 51.72,31.75 U$11.P4 40.51,31.75 39.24,30.48 34.92,30.48 34.61,30.8 27.72,30.8 27.4,30.48 26.04,30.48 24.92,31.59 v24.92,32.23 23.15,32.23 22.86,31.94 U$10.P4 22.73,31.62 21.43,31.62 20.29,30.48 3.81,30.48 U$9.P4
  Bottom 0.203: J3.3 24.92,32.54 v24.92,32.23
ROW20  (via drill 0.3)
  Top 0.203: U$12.P10 67.94,24.13 66.67,25.4 62.39,25.4 60.87,23.88 58.67,23.88 U$11.P10 57.15,25.4 41.53,25.4 40.26,24.13 U$10.P10 28.57,24.13 27.3,25.4 v24.61,25.4 21.62,25.4 20.38,24.16 17.81,24.16 U$9.P10
  Bottom 0.203: J3.4 24.61,29.69 v24.61,25.4
ROW21  (via drill 0.3)
  Top 0.203: 15.4,26.67 U$9.P6 | 15.4,26.67 16.67,25.4 20.32,25.4 21.59,26.67 U$10.P6 | J3.5 25.65,29.21 24.38,30.48 21.56,30.48 19.02,27.94 16.67,27.94 15.4,26.67 | v28.42,25.4 40.13,25.4 41.4,26.67 U$11.P6 43.56,27.05 47.56,27.05 v47.62,26.99 | v60.48,24.92 62.23,26.67 U$12.P6 | v60.48,21.91 60.48,21.4 59.4,20.32 53.37,20.32 52.2,21.5 v47.62,21.5
  Bottom 0.203: v28.42,25.4 27.94,25.88 27.94,27.94 J3.5 | v60.48,21.91 v60.48,24.92 | v47.62,26.99 v47.62,21.5
ROW22  (via drill 0.3)
  Top 0.203: U$9.P11 20.32,26.67 21.59,27.94 24,27.94 25.27,26.67 J3.6 34.29,26.67 | 34.29,26.67 U$10.P11 | v60.48,26.61 58.48,26.61 U$11.P11 | v60.48,40.64 63.02,43.18 79.22,43.18 80.49,41.91 80.49,27.53 79.63,26.67 U$12.P11 | v34.29,30 34.29,26.67 | v35.08,32.54 35.56,33.02 44.39,33.02 44.7,32.7 53.31,32.7 53.63,33.02 v60.33,33.02
  Bottom 0.203: v60.48,26.61 60.17,26.92 60.17,33.02 | 60.17,33.02 60.17,40.32 v60.48,40.64 | v34.29,30 35.08,30.8 v35.08,32.54 | 60.17,33.02 v60.33,33.02
ROW23  (via drill 0.3)
  Top 0.203: U$11.P15 60.2,36.83 61.47,35.56 65.66,35.56 | 65.66,35.56 77.47,35.56 U$12.P15 | U$9.P15 18.67,36.83 19.94,35.56 23.65,35.56 26.19,38.1 28.1,38.1 29.37,36.83 v36.04,36.83 U$10.P15 39.12,36.83 40.39,35.56 50.48,35.56 v50.96,35.08 | J3.7 27.18,24.13 27.97,23.34 v36.04,23.34 | v65.66,35.5 65.66,35.56 | v65.63,24.13 65.5,24.13 64.23,22.86 v53.02,22.86
  Bottom 0.203: v36.04,23.34 36.35,23.65 36.35,36.51 v36.04,36.83 | v65.66,35.5 65.63,35.47 v65.63,24.13 | v53.02,22.86 50.96,24.92 v50.96,35.08
ROW24  (via drill 0.3)
  Top 0.203: 29.53,38.42 30.48,39.37 U$10.P16 39.24,39.37 40.51,40.64 57.15,40.64 U$11.P16 60.83,39.37 62.1,40.64 77.47,40.64 U$12.P16 | 29.53,38.42 v29.21,38.1 | U$9.P16 18.32,39.91 20.89,39.91 21.62,40.64 27.15,40.64 29.37,38.42 29.53,38.42
  Bottom 0.203: J3.8 29.21,24.13 v29.21,38.1
ROW25  (via drill 0.3)
  Top 0.203: 36.83,12.7 19.05,12.7 U$13.P13 13.97,11.43 v13.34,12.06 | U$14.P13 36.83,12.7 | 36.83,12.7 55.88,12.7 57.15,11.43 U$15.P13 60.96,11.43 62.23,12.7 77.47,12.7 U$16.P13
  Bottom 0.203: v13.34,12.06 J8.1
ROW26
  Top 0.203: U$16.P3 62.23,13.97 60.96,12.7 57.4,12.7 56.13,13.97 U$15.P3 43.15,14 40.45,14 39.21,15.24 21.59,15.24 | 5.33,15.24 4.06,13.97 U$13.P3 | J8.2 6.35,16.26 5.33,15.24 | 21.59,15.24 U$14.P3 | 5.33,15.24 21.59,15.24
ROW27
  Top 0.203: U$13.P4 3.43,11.43 5.97,13.97 J8.3 10.16,10.16 20.45,10.16 21.72,11.43 U$14.P4 25.24,11.43 26.51,10.16 39.5,10.16 40.77,11.43 U$15.P4 55.5,11.43 56.77,10.16 60.96,10.16 62.23,11.43 U$16.P4
ROW28  (via drill 0.3)
  Top 0.203: U$16.P10 77.47,5.08 62.39,5.08 61.15,3.84 58.45,3.84 U$15.P10 56.77,3.81 55.5,5.08 41.91,5.08 40.64,3.81 U$14.P10 25.27,3.81 24,5.08 21.75,5.08 20.51,3.84 17.81,3.84 U$13.P10 | J8.4 10.16,7.62 v18.89,7.62
  Bottom 0.203: v18.89,7.62 19.3,7.21 19.3,5.21 17.91,3.81 U$13.P10
ROW29
  Top 0.203: 2.86,6.67 5.08,8.89 J8.5 | 2.86,6.67 U$13.P6 | 2.86,6.67 4.45,5.08 20.32,5.08 21.59,6.35 U$14.P6 24.13,6.35 25.4,5.08 40.64,5.08 41.91,6.35 U$15.P6 55.63,6.35 56.9,5.08 60.96,5.08 62.23,6.35 U$16.P6
ROW30
  Top 0.203: J8.6 U$13.P11 17.81,6.32 20.32,6.32 21.62,7.62 24.26,7.62 25.53,6.35 U$14.P11 40.51,6.35 41.78,7.62 55.75,7.62 57.02,6.35 U$15.P11 60.96,6.35 62.23,7.62 77.34,7.62 78.61,6.35 U$16.P11
ROW31  (via drill 0.3)
  Top 0.203: v15.72,16.03 16.19,16.51 U$13.P15 18.92,16.51 20.19,17.78 31.53,17.78 32.8,16.51 U$14.P15 39.37,16.51 40.64,15.24 57.15,15.24 | U$15.P15 57.15,15.24 | U$16.P15 77.47,15.24 57.15,15.24
  Bottom 0.203: J8.7 15.72,13.18 v15.72,16.03
ROW32
  Top 0.203: J8.8 4.95,1.27 3.68,2.54 1.68,2.54 0.79,3.43 0.79,14.64 1.4,15.24 3.33,15.24 5.87,17.78 14.13,17.78 15.4,19.05 U$13.P16 18.8,19.05 20.07,20.32 24.54,20.32 25.81,19.05 U$14.P16 38.86,19.05 40.13,20.32 51.59,20.32 52.86,19.05 U$15.P16 59.44,19.05 60.71,20.32 77.47,20.32 U$16.P16

### Text on the board
tNames: 16x 788BS / 1.9mm LED Modules | LED 32x32 Matrix / Display Breakout / RevB | Side A
bNames: COL1 | ROW1 | COL2 | ROW2 | COL3 | ROW3 | COL4 | ROW4 | COL5 | ROW5 | COL6 | ROW6 | COL7 | ROW7 | COL8 | ROW8 | COL9 | ROW9 | COL10 | ROW10 | COL11 | ROW11 | COL12 | ROW12 | COL13 | ROW13 | COL14 | ROW14 | COL15 | ROW15 | COL16 | ROW16 | COL17 | ROW17 | COL18 | ROW18 | COL19 | ROWXX: CATHODE / COLXX: ANODE | ROW19 | COL20 | ROW20 | COL21 | ROW21 | COL22 | ROW22 | COL23 | ROW23 | COL24 | ROW24 | COL25 | ROW25 | COL26 | ROW26 | COL27 | ROW27 | COL28 | ROW28 | Side B | COL29 | ROW29 | COL30 | ROW30 | COL31 | ROW31 | COL32 | ROW32